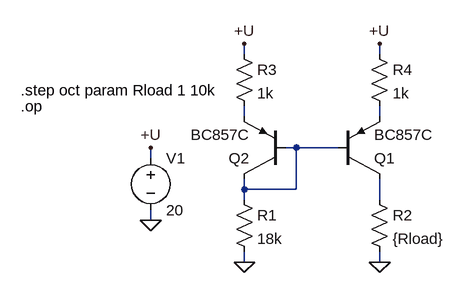
[diagram p0: schematic mirror-2.asc]
mirror-2.asc, the LTspice schematic file:
Version 4
SHEET 1 880 680
WIRE 192 -48 192 -64
WIRE 400 -48 400 -64
WIRE 192 48 192 32
WIRE 400 48 400 32
WIRE 272 96 256 96
WIRE 336 96 272 96
WIRE 48 112 48 96
WIRE 192 160 192 144
WIRE 272 160 272 96
WIRE 272 160 192 160
WIRE 192 176 192 160
WIRE 400 176 400 144
WIRE 48 208 48 192
WIRE 192 272 192 256
WIRE 400 272 400 256
FLAG 48 208 0
FLAG 48 96 +U
FLAG 192 272 0
FLAG 192 -64 +U
FLAG 400 -64 +U
FLAG 400 272 0
SYMBOL voltage 48 96 R0
WINDOW 123 0 0 Left 2
WINDOW 39 0 0 Left 2
SYMATTR InstName V1
SYMATTR Value 20
SYMBOL pnp 336 144 M180
SYMATTR InstName Q1
SYMATTR Value BC857C
SYMBOL pnp 256 144 R180
SYMATTR InstName Q2
SYMATTR Value BC857C
SYMBOL res 176 160 R0
SYMATTR InstName R1
SYMATTR Value 18k
SYMBOL res 384 160 R0
SYMATTR InstName R2
SYMATTR Value {Rload}
SYMBOL res 176 -64 R0
SYMATTR InstName R3
SYMATTR Value 1k
SYMBOL res 384 -64 R0
SYMATTR InstName R4
SYMATTR Value 1k
TEXT -152 8 Left 2 !.step oct param Rload 1 10k
TEXT -152 32 Left 2 !.op

The netlist it stands for:
* mirror-2.asc
V1 +U 0 20
Q1 N004 N003 N002 0 BC857C
Q2 N003 N003 N001 0 BC857C
R1 N003 0 18k
R2 N004 0 {Rload}
R3 +U N001 1k
R4 +U N002 1k
.model NPN NPN
.model PNP PNP
.lib standard.bjt
.step oct param Rload 1 10k
.op
.backanno
.end